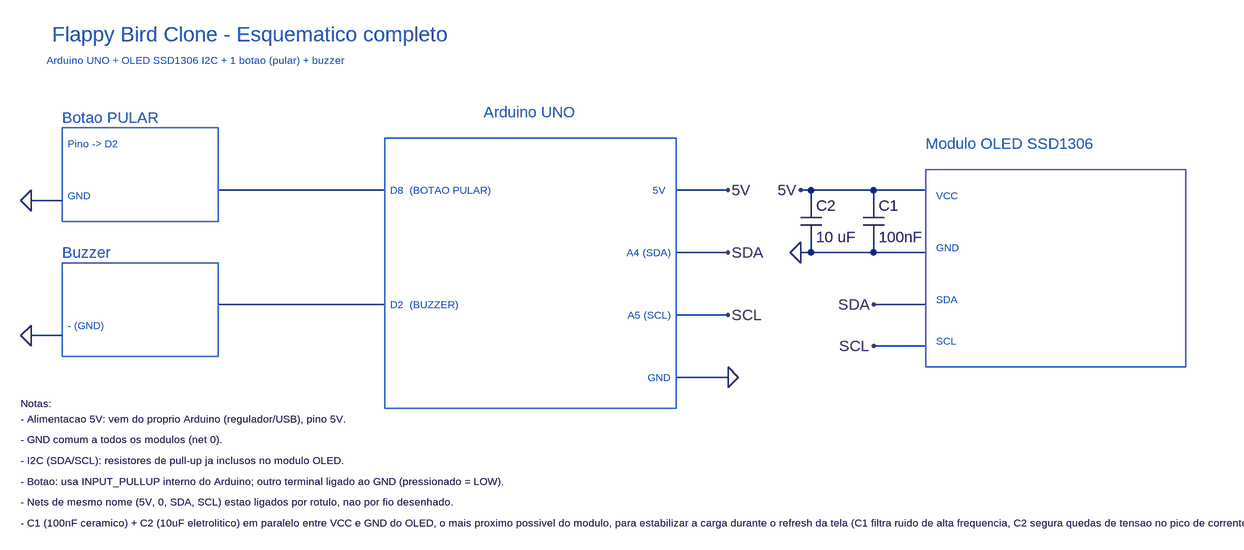
[diagram p0: schematic Draft1.asc]
Draft1.asc, the LTspice schematic file:
Version 4.1
SHEET 1 3224 1000
WIRE 688 384 432 384
WIRE 1216 384 1136 384
WIRE 1344 384 1328 384
WIRE 1440 384 1344 384
WIRE 1520 384 1440 384
WIRE 192 400 144 400
WIRE 1344 400 1344 384
WIRE 1440 400 1440 384
WIRE 1216 480 1136 480
WIRE 1344 480 1344 464
WIRE 1344 480 1328 480
WIRE 1440 480 1440 464
WIRE 1440 480 1344 480
WIRE 1520 480 1440 480
WIRE 688 560 432 560
WIRE 1520 560 1440 560
WIRE 1216 576 1136 576
WIRE 192 608 144 608
WIRE 1520 624 1440 624
WIRE 1216 672 1136 672
FLAG 144 400 0
FLAG 144 608 0
FLAG 1216 384 5V
FLAG 1216 480 SDA
FLAG 1216 576 SCL
FLAG 1216 672 0
FLAG 1328 384 5V
FLAG 1328 480 0
FLAG 1440 560 SDA
FLAG 1440 624 SCL
SYMBOL cap 1424 400 R0
SYMATTR InstName C1
SYMATTR Value 100nF
SYMBOL cap 1328 400 R0
SYMATTR InstName C2
SYMATTR Value 10 uF
TEXT 176 144 Left 3 ;Flappy Bird Clone - Esquematico completo
TEXT 168 184 Left 1 ;Arduino UNO + OLED SSD1306 I2C + 1 botao (pular) + buzzer
TEXT 840 264 Left 2 ;Arduino UNO
TEXT 696 384 Left 1 ;D8  (BOTAO PULAR)
TEXT 696 560 Left 1 ;D2  (BUZZER)
TEXT 1120 384 Right 1 ;5V
TEXT 1128 480 Right 1 ;A4 (SDA)
TEXT 1128 576 Right 1 ;A5 (SCL)
TEXT 1128 672 Right 1 ;GND
TEXT 192 272 Left 2 ;Botao PULAR
TEXT 200 312 Left 1 ;Pino -> D2
TEXT 200 392 Left 1 ;GND
TEXT 192 480 Left 2 ;Buzzer
TEXT 200 592 Left 1 ;- (GND)
TEXT 1520 312 Left 2 ;Modulo OLED SSD1306
TEXT 1536 392 Left 1 ;VCC
TEXT 1536 472 Left 1 ;GND
TEXT 1536 552 Left 1 ;SDA
TEXT 1536 616 Left 1 ;SCL
TEXT 128 712 Left 1 !Notas:
TEXT 128 736 Left 1 !- Alimentacao 5V: vem do proprio Arduino (regulador/USB), pino 5V.
TEXT 128 768 Left 1 !- GND comum a todos os modulos (net 0).
TEXT 128 800 Left 1 !- I2C (SDA/SCL): resistores de pull-up ja inclusos no modulo OLED.
TEXT 128 832 Left 1 !- Botao: usa INPUT_PULLUP interno do Arduino; outro terminal ligado ao GND (pressionado = LOW).
TEXT 128 864 Left 1 !- Nets de mesmo nome (5V, 0, SDA, SCL) estao ligados por rotulo, nao por fio desenhado.
TEXT 128 896 Left 1 !- C1 (100nF ceramico) + C2 (10uF eletrolitico) em paralelo entre VCC e GND do OLED, o mais proximo possivel do modulo, para estabilizar a carga durante o refresh da tela (C1 filtra ruido de alta frequencia, C2 segura quedas de tensao no pico de corrente).
RECTANGLE Normal 688 304 1136 720
RECTANGLE Normal 192 288 432 432
RECTANGLE Normal 192 496 432 640
RECTANGLE Normal 1520 352 1920 656

The netlist it stands for:
* Draft1.asc
C1 5V 0 100nF
C2 5V 0 10 uF
* Flappy Bird Clone - Esquematico completo
* Arduino UNO + OLED SSD1306 I2C + 1 botao (pular) + buzzer
* Arduino UNO
* D8  (BOTAO PULAR)
* D2  (BUZZER)
* 5V
* A4 (SDA)
* A5 (SCL)
* GND
* Botao PULAR
* Pino -> D2
* GND
* Buzzer
* - (GND)
* Modulo OLED SSD1306
* VCC
* GND
* SDA
* SCL
Notas:
- Alimentacao 5V: vem do proprio Arduino (regulador/USB), pino 5V.
- GND comum a todos os modulos (net 0).
- I2C (SDA/SCL): resistores de pull-up ja inclusos no modulo OLED.
- Botao: usa INPUT_PULLUP interno do Arduino; outro terminal ligado ao GND (pressionado = LOW).
- Nets de mesmo nome (5V, 0, SDA, SCL) estao ligados por rotulo, nao por fio desenhado.
- C1 (100nF ceramico) + C2 (10uF eletrolitico) em paralelo entre VCC e GND do OLED, o mais proximo possivel do modulo, para estabilizar a carga durante o refresh da tela (C1 filtra ruido de alta frequencia, C2 segura quedas de tensao no pico de corrente).
.backanno
.end